# EAGLE design sensorboard (EAGLE 5.11)
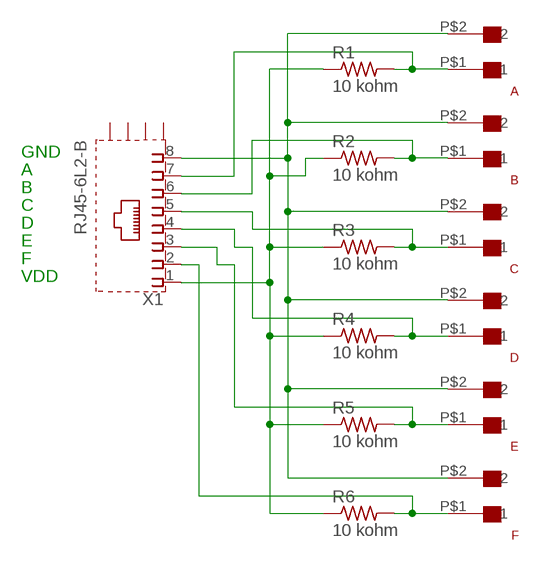
[diagram p0: schematic, sheet 1]

## Parts
A  XH-2  [XH-2]
B  XH-2  [XH-2]
C  XH-2  [XH-2]
D  XH-2  [XH-2]
E  XH-2  [XH-2]
F  XH-2  [XH-2]
R1  10 kohm  R-US_0207/7  [0207/7]
R2  10 kohm  R-US_0207/7  [0207/7]
R3  10 kohm  R-US_0207/7  [0207/7]
R4  10 kohm  R-US_0207/7  [0207/7]
R5  10 kohm  R-US_0207/7  [0207/7]
R6  10 kohm  R-US_0207/7  [0207/7]
X1  RJ45-6L2-B  [RJ45-SHIELD2]

## Nets
N$1: A.P$2 B.P$2 C.P$2 D.P$2 E.P$2 F.P$2 X1.8
N$2: R1.1 R2.1 R3.1 R4.1 R5.1 R6.1 X1.1
N$3: A.P$1 R1.2 X1.7
N$4: B.P$1 R2.2 X1.6
N$5: C.P$1 R3.2 X1.5
N$6: D.P$1 R4.2 X1.4
N$7: E.P$1 R5.2 X1.3
N$8: F.P$1 R6.2 X1.2
Unconnected: X1.S1(S) X1.S2(S) X1.S3(S) X1.S4(S)

## Notes on the sheet
- GND
- A
- B
- C
- D
- E
- F
- VDD

## Library data of the parts
A B C D E F = myparts:XH-2
R1-R6 = resistor:R-US_: RESISTOR, American symbol
X1 = con-tycoelectronics:RJ45*2: RJ45 Low Profile Shield Type 2 For all RJ45 L, LC, LCT and X Series Models Source: www.tycoelectronics.com .. ENG_DS_1654001_1099_RJ_L_0507.pdf; MPN: RJ45-6L2-B; OC_FARNELL: unknown; OC_NEWARK: 16R6096

## Board
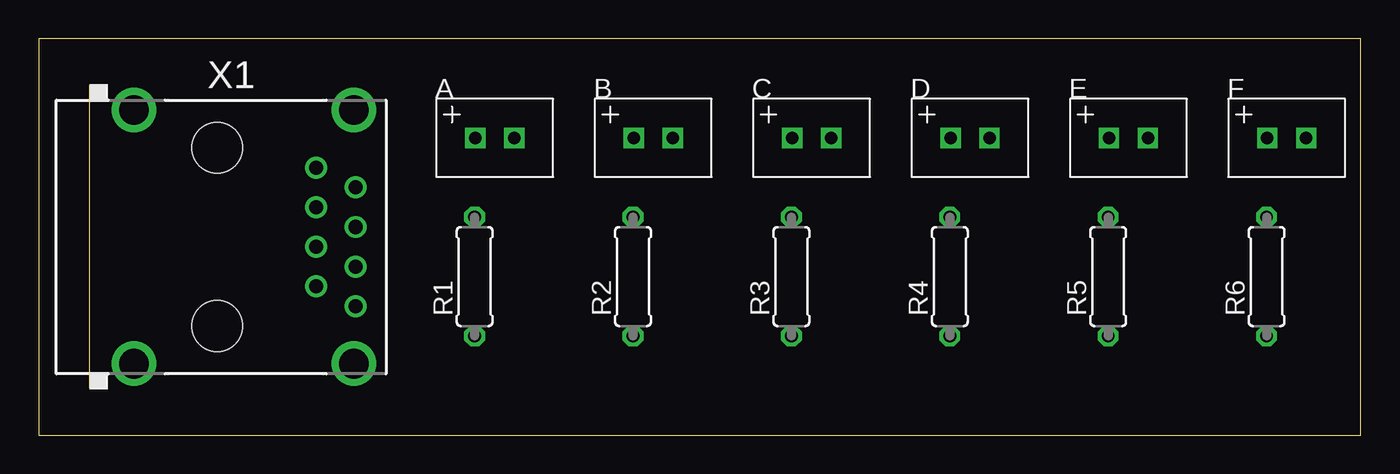
[diagram p1: board, top side]
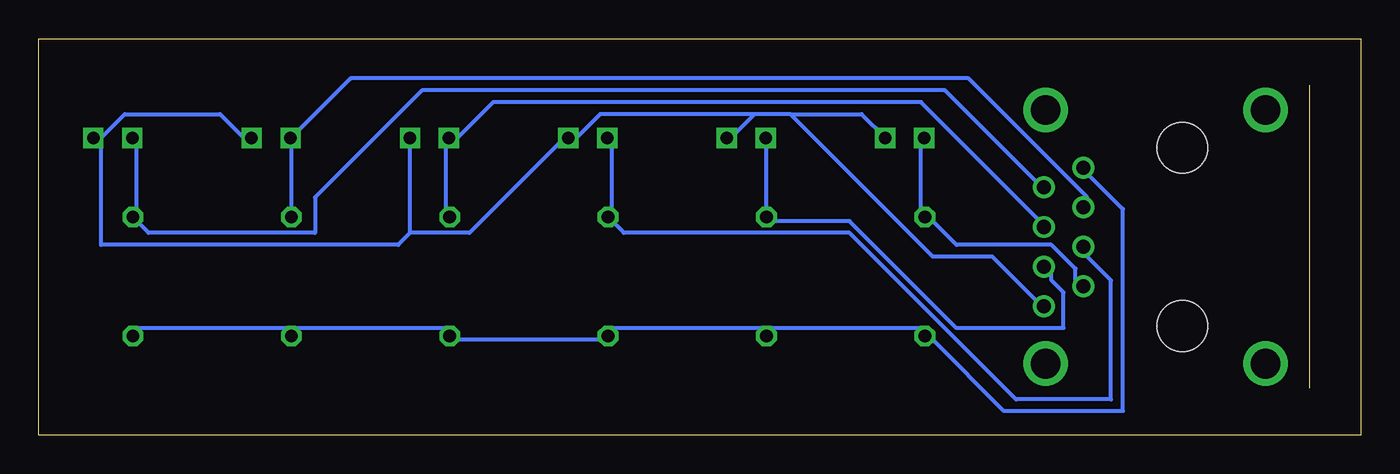
[diagram p2: board, bottom side, seen from below]

Size 84.76 x 25.39 mm. Coordinates in mm from the lower left corner, seen from the top.
Outline: 0,0 84.76,0 84.76,25.39 0,25.39 0,0
Copper layers (1*16): Top 0.035mm / dielectric 1.5mm / Bottom 0.035mm
Design rules "default": minimum track width 10mil, minimum drill 24mil, track to track 8mil, track to pad 8mil, pad to pad 8mil, via to via 8mil, smd to smd 8mil, copper to edge 40mil, drill to drill 8mil, minimum pad ring 10mil, minimum via ring 8mil, stop-mask expansion 4mil, vias tented up to drill 0mil, thermal gap 10mil

### Footprints (pad centres in the part's own frame; a part is rotated, then mirrored left to right if it is on the bottom)
XH-2 = drill 0.8 square: P$1 -2.5,0; P$2 0,0
0207/7 = drill 0.813 octagon: 1 -3.81,0; 2 3.81,0
RJ45-SHIELD2 = drill 0.9 pad 1.4 round: 1 -4.445,6.35; 2 -3.175,8.89; 3 -1.905,6.35; 4 -0.635,8.89; 5 0.635,6.35; 6 1.905,8.89; 7 3.175,6.35; 8 4.445,8.89 | drill 1.9 pad 2.5 round: S1 -8.128,-5.33; S2 8.128,-5.33; S3 -8.128,8.76; S4 8.128,8.76 | hole 3.251: -5.715,0; 5.715,0

### Placement (x,y rotation side)
A  30.48,19.05 0 top
B  40.64,19.05 0 top
C  50.8,19.05 0 top
D  60.96,19.05 0 top
E  71.12,19.05 0 top
F  81.28,19.05 0 top
R1  27.94,10.16 90 top
R2  38.1,10.16 90 top
R3  48.26,10.16 90 top
R4  58.42,10.16 90 top
R5  68.58,10.16 90 top
R6  78.74,10.16 90 top
X1  11.43,12.7 270 top

### Tracks (layer width: path | path; a pad name or v marks a point on that pad's centre or on a via)
N$1
  Bottom 0.254: 80.77,19.05 79.25,20.57 73.15,20.57 71.63,19.05 E.P$2 | A.P$2 32,20.57 36.58,20.57 | 36.58,20.57 38.86,20.57 | 38.86,20.57 40.39,19.05 B.P$2 | 38.86,20.57 48.77,20.57 50.29,19.05 C.P$2 51.05,19.05 57.15,12.95 60.96,12.95 | 60.96,12.95 D.P$2 | 36.58,20.57 27.43,11.43 23.62,11.43 20.57,8.38 X1.8 | 80.77,19.05 80.77,12.19 61.72,12.19 60.96,12.95 | 80.77,19.05 F.P$2
N$2
  Bottom 0.254: 68.58,6.86 58.67,6.86 R4.1 57.91,6.1 48.77,6.1 R3.1 48.01,6.86 38.1,6.86 | 68.58,6.86 78.49,6.86 R6.1 | 68.58,6.86 R5.1 | 38.1,6.86 28.19,6.86 R1.1 27.43,6.1 22.86,1.52 15.24,1.52 15.24,14.48 17.53,16.76 X1.1 | 38.1,6.86 R2.1
N$3
  Bottom 0.254: A.P$1 28.19,19.05 28.19,14.48 R1.2 27.43,13.72 25.91,12.19 19.81,12.19 18.29,10.67 18.29,9.91 X1.7
N$4
  Bottom 0.254: B.P$1 38.1,19.05 R2.2 38.1,13.72 32.77,13.72 25.91,6.86 19.05,6.86 19.05,9.14 19.81,9.91 19.81,10.67 X1.6
N$5
  Bottom 0.254: C.P$1 48.01,19.05 48.01,14.48 R3.2 47.24,12.95 32.77,12.95 22.1,2.29 16,2.29 16,9.91 17.53,11.43 X1.5
N$6
  Bottom 0.254: R4.2 58.67,14.48 58.67,19.05 D.P$1 57.91,19.05 55.63,21.34 28.19,21.34 20.57,13.72 X1.4
N$7
  Bottom 0.254: 68.58,19.05 R5.2 | 68.58,19.05 64.77,22.86 25.15,22.86 17.53,15.24 X1.3 | 68.58,19.05 E.P$1
N$8
  Bottom 0.254: F.P$1 78.49,19.05 78.49,14.48 R6.2 77.72,12.95 67.06,12.95 67.06,15.24 60.2,22.1 26.67,22.1 20.57,16 X1.2